# Altium project MC Alarm.PrjPcb (part 2 of 2)
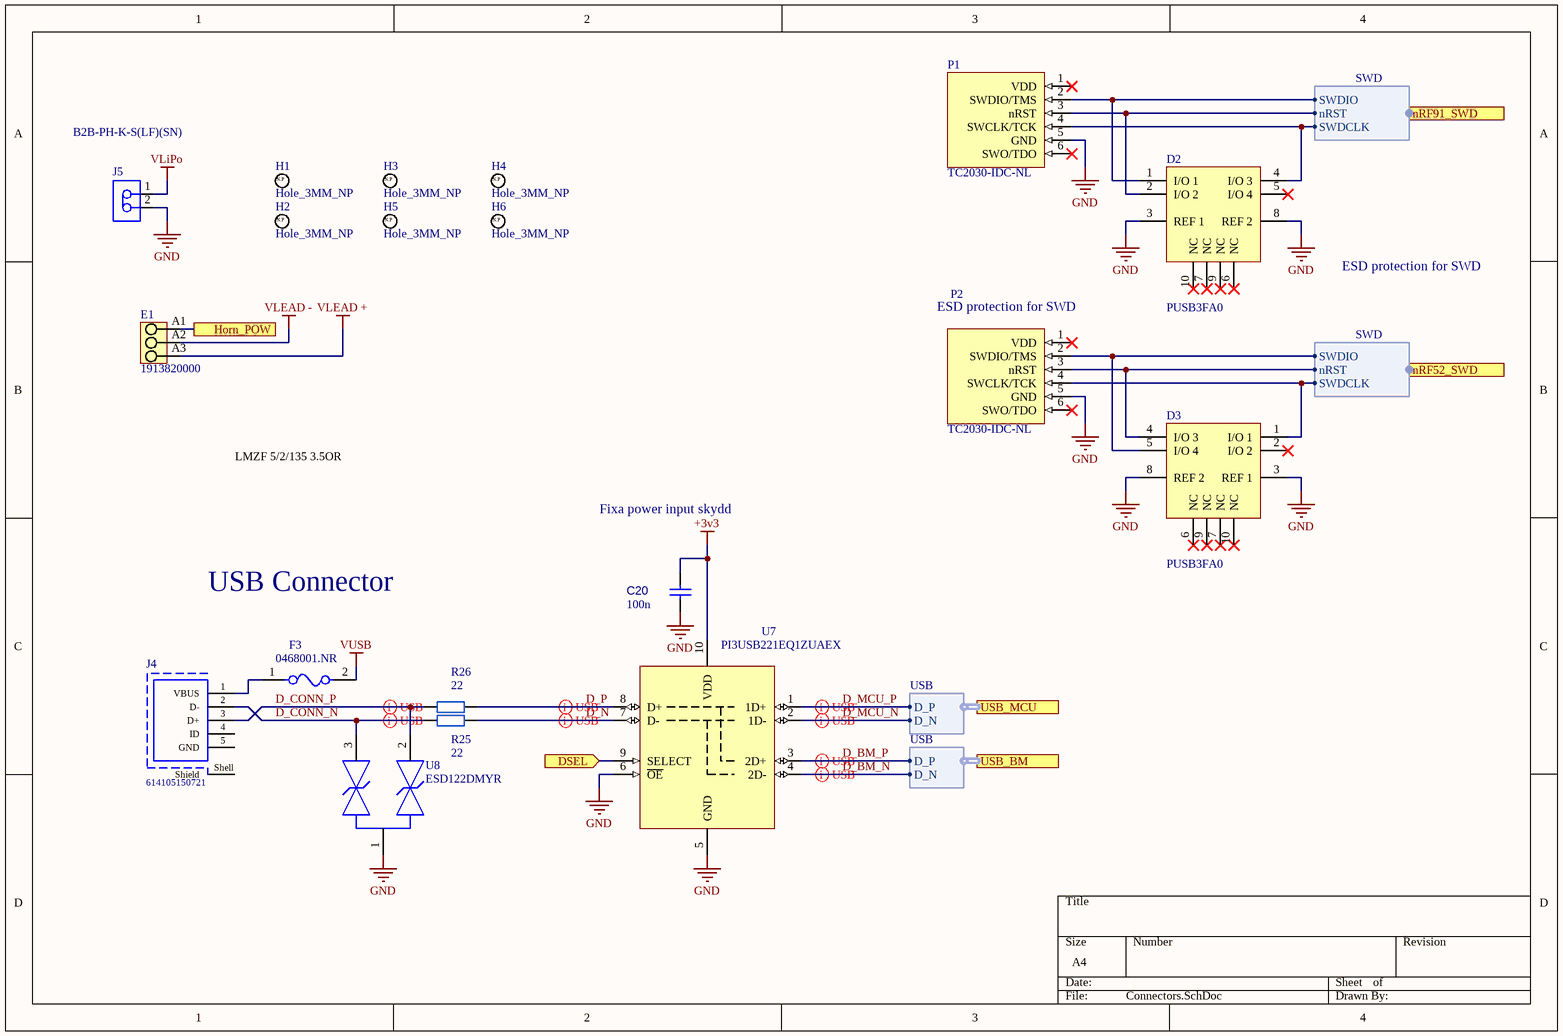
[diagram p6: Connectors.SchDoc]

## Nets that join several sheets
+1v8: Power (6 pins), NRF9160 (7 pins), NRF52840 (14 pins), Sensors and peripherals (7 pins)
+3v3: Power (5 pins), NRF9160 (10 pins), Sensors and peripherals (D1.2), Connectors (C20.2 U7.10)
GND: Power (42 pins), NRF9160 (59 pins), NRF52840 (35 pins), Sensors and peripherals (20 pins), Connectors (11 pins)
VLEAD +: Power (F1.1), Sensors and peripherals (R29.2), Connectors (E1.A3)
VLEAD -: Power (L6.1), Connectors (E1.A2)
VLIPO: Power (C1.2 U3.13 U3.14), Connectors (J5.1)
VUSB: Power (C19.2 U3.1), NRF52840 (C58.2 U10.AD2), Connectors (F3.2)
~{BM_EN}: Power (R31.2 U3.9), NRF52840 (U10.A16)
BCK P_GOOD: Power (R14.1 TP15.1 U2.24), NRF9160 (U1.20)
Blue_LED: NRF9160 (U1.87), Sensors and peripherals (R24.1)
BM_INT: Power (TP14.1 U3.7), NRF52840 (U10.A14)
COEX0: NRF9160 (TP4.1 U1.93), NRF52840 (U10.AD8)
COEX1: NRF9160 (TP3.1 U1.92), NRF52840 (U10.U24)
COEX2: NRF9160 (TP1.1 U1.91), NRF52840 (U10.AD10)
CTS_INT_MCU: NRF9160 (TP7.1 U1.16), NRF52840 (U10.N1)
D_BM_N: Power (U3.3), Connectors (U7.4)
D_BM_P: Power (U3.2), Connectors (U7.3)
D_MCU_N: NRF52840 (U10.AD4), Connectors (U7.2)
D_MCU_P: NRF52840 (U10.AD6), Connectors (U7.1)
DSEL: Power (C29.2 U3.24), Connectors (U7.9)
Green_LED: NRF9160 (U1.86), Sensors and peripherals (R22.1)
~{Horn}: NRF9160 (U1.24), Sensors and peripherals (R30.1)
INT_IMU: NRF9160 (U1.42), Sensors and peripherals (U5.12)
LOW P-MODE: Power (TP16.1 U2.20), NRF9160 (U1.25)
NetE1_A1: Sensors and peripherals (F2.1), Connectors (E1.A1)
nRF52_RST: NRF52840 (5 pins), Connectors (D3.4 P2.3)
nRF52_SWCLK: NRF52840 (U10.AA24), Connectors (D3.1 P2.4)
nRF52_SWDIO: NRF52840 (U10.AC24), Connectors (D3.5 P2.2)
nRF91_RST: NRF9160 (5 pins), Connectors (D2.2 P1.3)
Red_LED: NRF9160 (U1.84), Sensors and peripherals (R23.1)
RTS_INT_MCU: NRF9160 (TP6.1 U1.15), NRF52840 (U10.R1)
RX_INT_MCU: NRF9160 (TP9.1 U1.19), NRF52840 (U10.J1)
SCL: Power (U3.6), NRF9160 (R2.1 TP5.1 U1.88), NRF52840 (U10.AD18), Sensors and peripherals (U5.23 U6.B2)
SDA: Power (U3.5), NRF9160 (R32.1 TP2.1 U1.89), NRF52840 (U10.AD16), Sensors and peripherals (U5.24 U6.B1)
SIM_1V8: NRF9160 (U1.49), Sensors and peripherals (C14.2 J3.C1 U4.A4)
SIM_CLK: NRF9160 (U1.46), Sensors and peripherals (U4.A2)
SIM_IO: NRF9160 (U1.48), Sensors and peripherals (U4.A3)
SIM_RST: NRF9160 (U1.43), Sensors and peripherals (U4.A1)
TX_INT_MCU: NRF9160 (TP8.1 U1.18), NRF52840 (U10.L1)